# EAGLE design tablespoon-no-adc (EAGLE 6.5.0)
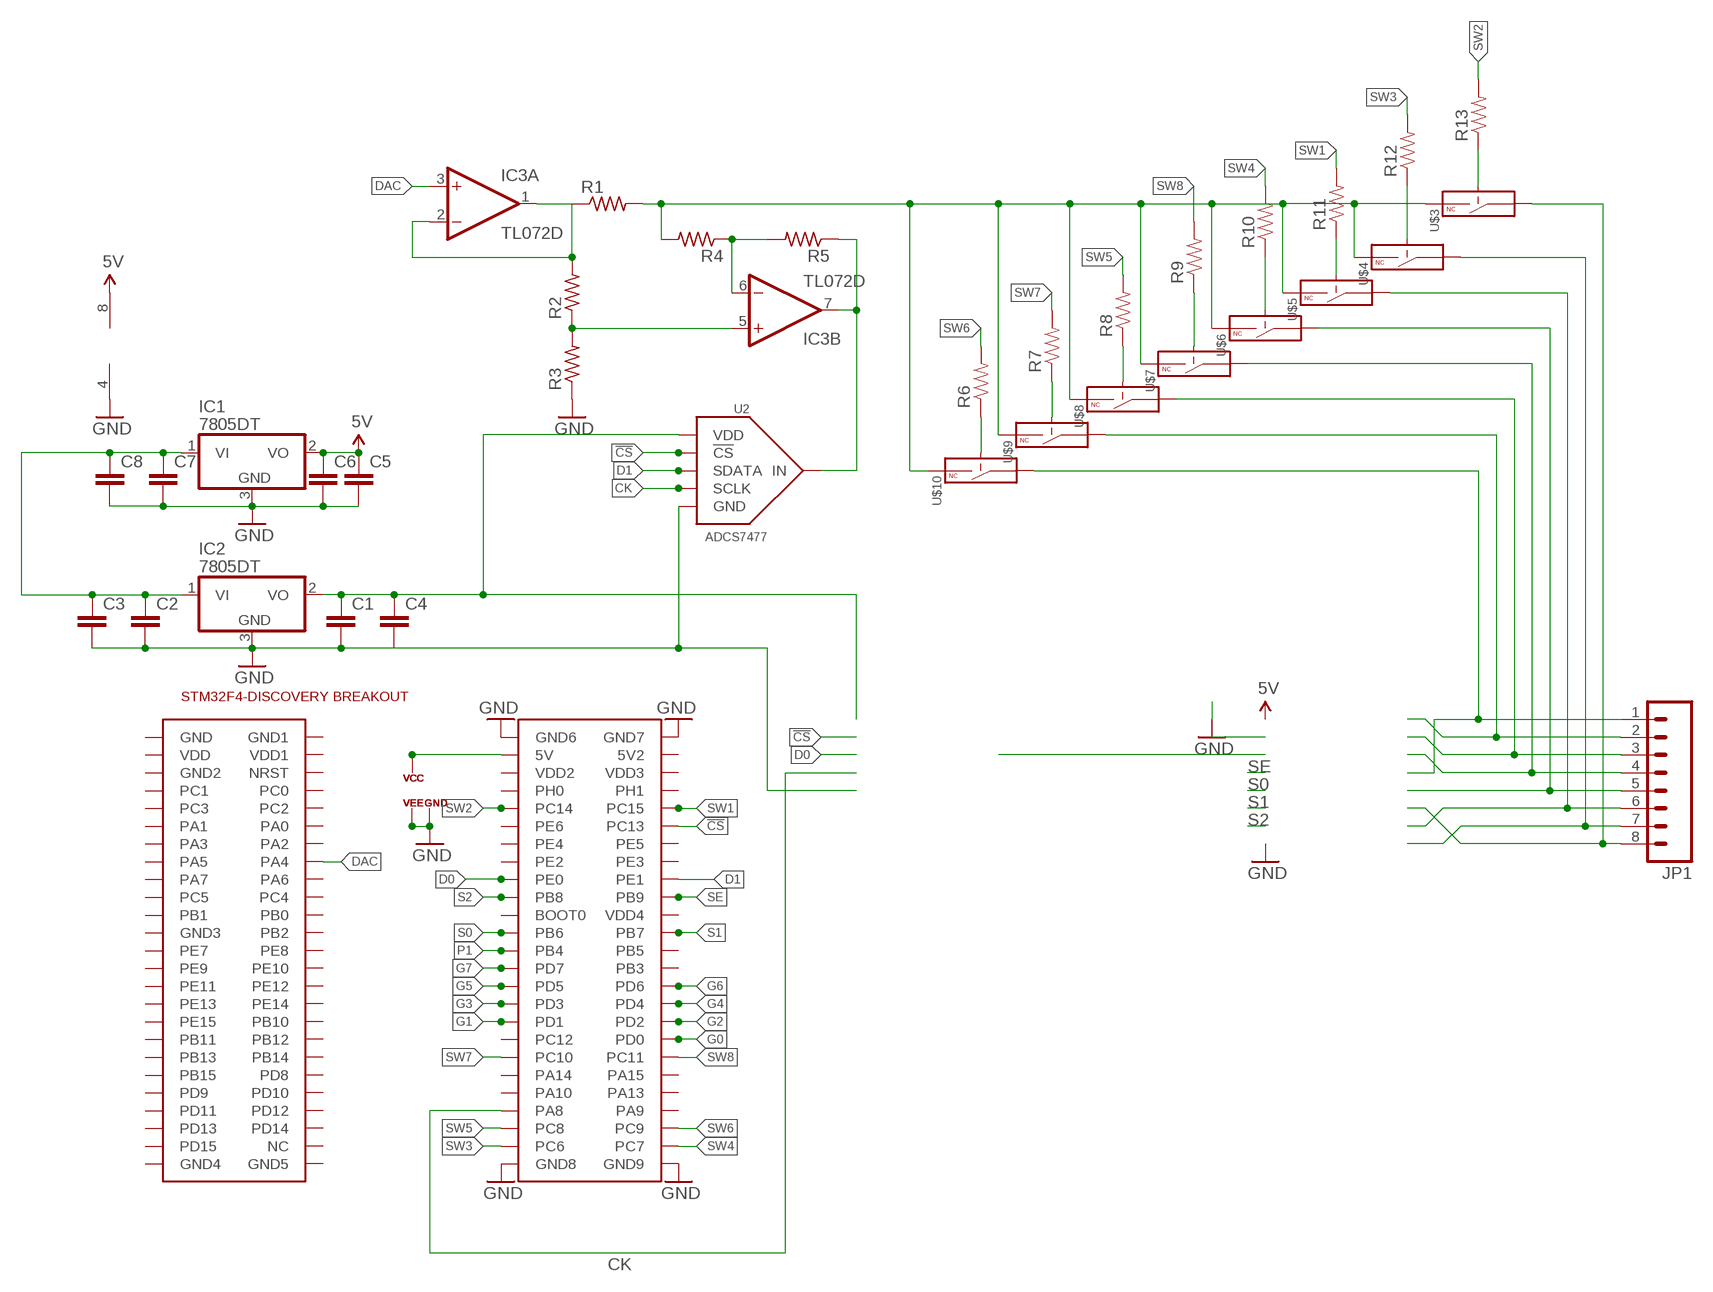
[diagram p0: schematic, sheet 1]

## Parts
C1  C-EUC0805  [C0805]
C2  C-EUC0805  [C0805]
C3  C-EUC0805  [C0805]
C4  C-EUC0805  [C0805]
C5  C-EUC0805  [C0805]
C6  C-EUC0805  [C0805]
C7  C-EUC0805  [C0805]
C8  C-EUC0805  [C0805]
IC1  7805DT  [TO252]
IC2  7805DT  [TO252]
IC3  TL072D  [SO08]
JP1  M08LONGPADS  [1X08_LONGPADS]
R1  R-US_R0603  [R0603]
R2  R-US_R0603  [R0603]
R3  R-US_R0603  [R0603]
R4  R-US_R0603  [R0603]
R5  R-US_R0603  [R0603]
R6  RESISTOR0805-RES  [0805]
R7  RESISTOR0805-RES  [0805]
R8  RESISTOR0805-RES  [0805]
R9  RESISTOR0805-RES  [0805]
R10  RESISTOR0805-RES  [0805]
R11  RESISTOR0805-RES  [0805]
R12  RESISTOR0805-RES  [0805]
R13  RESISTOR0805-RES  [0805]
U2  ADCS7477  [SOT-23-6]
U$1  STM32F4-DISCOVERY  [STM32F4-DISCOVERY]
U$3  DG467  [TSSOP-6]
U$4  DG467  [TSSOP-6]
U$5  DG467  [TSSOP-6]
U$6  DG467  [TSSOP-6]
U$7  DG467  [TSSOP-6]
U$8  DG467  [TSSOP-6]
U$9  DG467  [TSSOP-6]
U$10  DG467  [TSSOP-6]

## Nets
4.6V: U$1.P$53(5V) U$3.P$5(VCC) U$4.P$5(VCC) U$5.P$5(VCC) U$6.P$5(VCC) U$7.P$5(VCC) U$8.P$5(VCC) U$9.P$5(VCC) U$10.P$5(VCC)
5V: C5.1 C6.1 IC1.2(VO) IC3.8(P:V+)
!CS: U2.P$6(!CS) U$1.P$62(PC13)
CK: U2.P$4(SCLK) U$1.P$93(PA8)
CUR: IC3.7(B:OUT) R5.1 U2.P$3(IN)
D0: U$1.P$67(PE0)
D1: U2.P$5(SDATA) U$1.P$68(PE1)
DAC: IC3.3(A:+IN) U$1.P$16(PA4)
G0: U$1.P$86(PD0)
G1: U$1.P$83(PD1)
G2: U$1.P$84(PD2)
G3: U$1.P$81(PD3)
G4: U$1.P$82(PD4)
G5: U$1.P$79(PD5)
G6: U$1.P$80(PD6)
G7: U$1.P$77(PD7)
GND: C1.2 C2.2 C3.2 C4.2 C5.2 C6.2 C7.2 C8.2 IC1.3(GND) IC2.3(GND) IC3.4(P:V-) R3.1 U2.P$2(GND) U$1.P$51(GND6) U$1.P$52(GND7) U$1.P$99(GND8) U$1.P$100(GND9) U$3.P$2(VEE) U$3.P$4(GND) U$4.P$2(VEE) U$4.P$4(GND) U$5.P$2(VEE) U$5.P$4(GND) U$6.P$2(VEE) U$6.P$4(GND) U$7.P$2(VEE) U$7.P$4(GND) U$8.P$2(VEE) U$8.P$4(GND) U$9.P$2(VEE) U$9.P$4(GND) U$10.P$2(VEE) U$10.P$4(GND)
N$2: C1.1 C4.1 IC2.2(VO) U2.P$1(VDD)
N$4: R6.1 U$10.P$3(CTL)
N$5: C2.1 C3.1 C7.1 C8.1 IC1.1(VI) IC2.1(VI)
N$6: JP1.4 U$7.P$6(COM)
N$7: R7.1 U$9.P$3(CTL)
N$8: IC3.1(A:OUT) IC3.2(A:-IN) R1.1 R2.2
N$9: JP1.5 U$6.P$6(COM)
N$10: JP1.3 U$8.P$6(COM)
N$11: JP1.1 U$10.P$6(COM)
N$12: JP1.2 U$9.P$6(COM)
N$13: IC3.5(B:+IN) R2.1 R3.2
N$14: IC3.6(B:-IN) R4.1 R5.2
N$15: R8.1 U$8.P$3(CTL)
N$16: R1.2 R4.2 U$3.P$1(IN) U$4.P$1(IN) U$5.P$1(IN) U$6.P$1(IN) U$7.P$1(IN) U$8.P$1(IN) U$9.P$1(IN) U$10.P$1(IN)
N$17: R9.1 U$7.P$3(CTL)
N$18: R12.1 U$4.P$3(CTL)
N$19: R13.1 U$3.P$3(CTL)
N$20: R11.1 U$5.P$3(CTL)
N$21: R10.1 U$6.P$3(CTL)
N$27: JP1.6 U$5.P$6(COM)
N$28: JP1.7 U$4.P$6(COM)
N$29: JP1.8 U$3.P$6(COM)
P1: U$1.P$75(PB4)
S0: U$1.P$73(PB6)
S1: U$1.P$74(PB7)
S2: U$1.P$69(PB8)
SE: U$1.P$70(PB9)
SW1: R11.2 U$1.P$60(PC15)
SW2: R13.2 U$1.P$59(PC14)
SW3: R12.2 U$1.P$97(PC6)
SW4: R10.2 U$1.P$98(PC7)
SW5: R8.2 U$1.P$95(PC8)
SW6: R6.2 U$1.P$96(PC9)
SW7: R7.2 U$1.P$87(PC10)
SW8: R9.2 U$1.P$88(PC11)
Unconnected: U$1.P$1(GND) U$1.P$2(GND1) U$1.P$3(VDD) U$1.P$4(VDD1) U$1.P$5(GND2) U$1.P$6(NRST) U$1.P$7(PC1) U$1.P$8(PC0) U$1.P$9(PC3) U$1.P$10(PC2) U$1.P$11(PA1) U$1.P$12(PA0) U$1.P$13(PA3) U$1.P$14(PA2) U$1.P$15(PA5) U$1.P$17(PA7) U$1.P$18(PA6) U$1.P$19(PC5) U$1.P$20(PC4) U$1.P$21(PB1) U$1.P$22(PB0) U$1.P$23(GND3) U$1.P$24(PB2) U$1.P$25(PE7) U$1.P$26(PE8) U$1.P$27(PE9) U$1.P$28(PE10) U$1.P$29(PE11) U$1.P$30(PE12) U$1.P$31(PE13) U$1.P$32(PE14) U$1.P$33(PE15) U$1.P$34(PB10) U$1.P$35(PB11) U$1.P$36(PB12) U$1.P$37(PB13) U$1.P$38(PB14) U$1.P$39(PB15) U$1.P$40(PD8) U$1.P$41(PD9) U$1.P$42(PD10) U$1.P$43(PD11) U$1.P$44(PD12) U$1.P$45(PD13) U$1.P$46(PD14) U$1.P$47(PD15) U$1.P$48(NC) U$1.P$49(GND4) U$1.P$50(GND5) U$1.P$54(5V2) U$1.P$55(VDD2) U$1.P$56(VDD3) U$1.P$57(PH0) U$1.P$58(PH1) U$1.P$61(PE6) U$1.P$63(PE4) U$1.P$64(PE5) U$1.P$65(PE2) U$1.P$66(PE3) U$1.P$71(BOOT0) U$1.P$72(VDD4) U$1.P$76(PB5) U$1.P$78(PB3) U$1.P$85(PC12) U$1.P$89(PA14) U$1.P$90(PA15) U$1.P$91(PA10) U$1.P$92(PA13) U$1.P$94(PA9)

## Library data of the parts
C1-C8 = rcl:C-EU: CAPACITOR, European symbol
IC1 IC2 = linear:78*: Positive VOLTAGE REGULATOR Source: http://cache.national.com/ds/LM/LM78L05.pdf http://www.fairchildsemi.com/ds/LM/LM7805.pdf
IC3 = linear:TL072: OP AMP
JP1 = SparkFun-Connectors:M08: Header 8 Standard 8-pin 0.1" header. Use with straight break away headers (SKU : PRT-00116), right angle break away headers (PRT-00553), swiss pins (PRT-00743), machine pins (PRT-00117), and female headers (PRT-00115).
R1-R5 = rcl:R-US_: RESISTOR, American symbol
R6-R13 = SparkFun-Passives:RESISTOR: Resistor Basic schematic elements and footprints for 0603, 1206, and PTH resistors.
U2 = butter:ADCS7477: TI ADCS7477 10 bit 1MSPS ADC 5V 10mW Digikey <http://www.digikey.com/product-detail/en/ADCS7477AIMF%2FNOPB/ADCS7477AIMF%2FNOPBTR-ND/568478>
U$1 = STM32F4-DISCOVERY:STM32F4-DISCOVERY
U$3-U$10 = butter:DG467

## Board
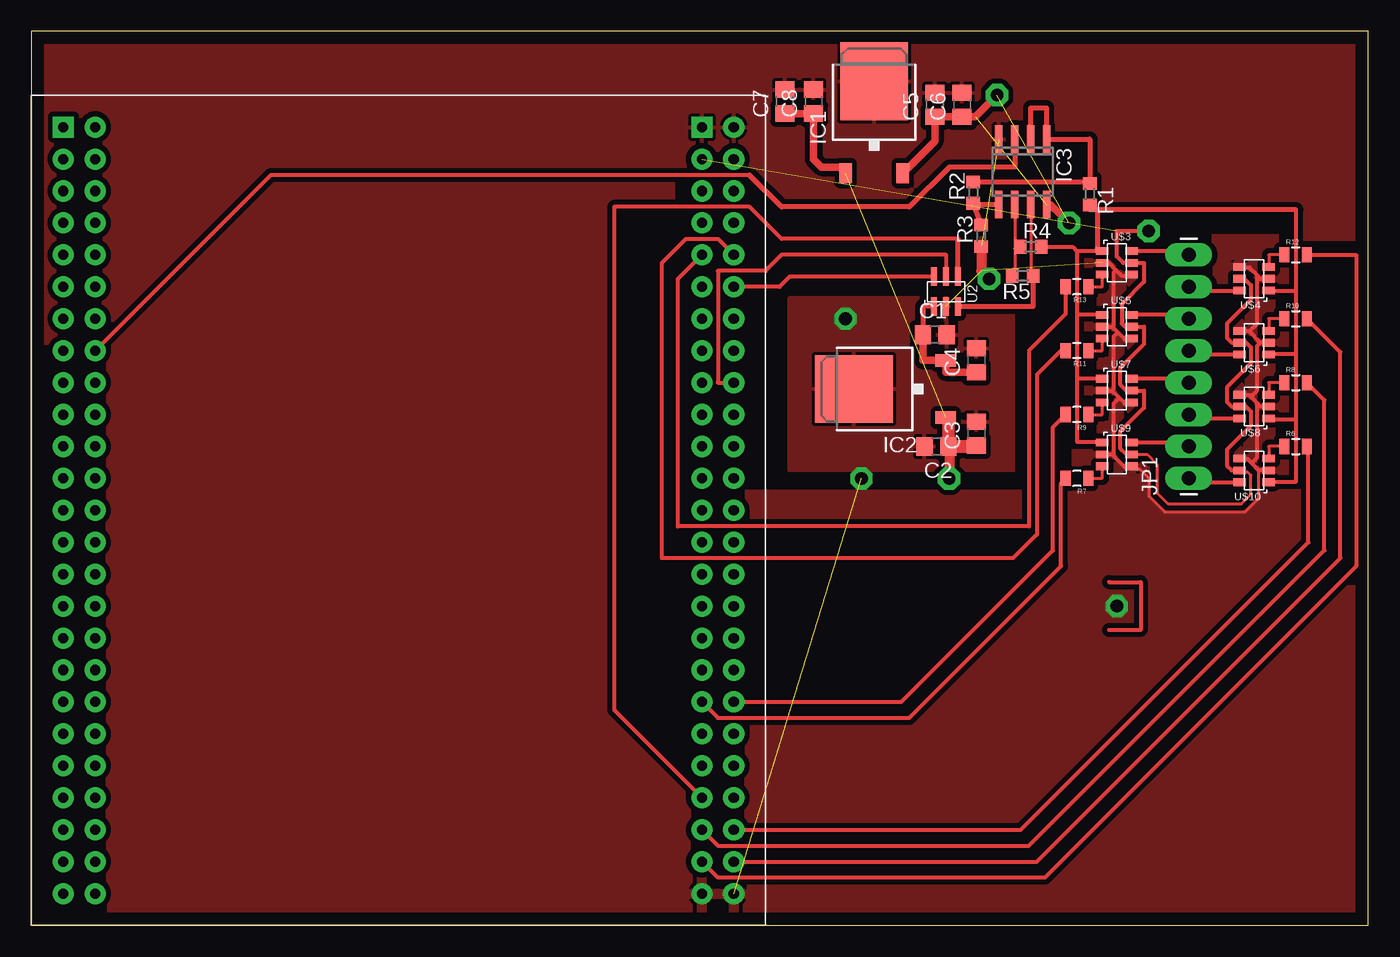
[diagram p1: board, top side]

Size 106.35 x 71.11 mm. Coordinates in mm from the lower left corner, seen from the top.
Outline: 0,0 106.35,0 106.35,71.11 0,71.11 0,0
Copper layers (1*16): Top 0.035mm / dielectric 1.5mm / Bottom 0.035mm
Design rules "default": minimum track width 10mil, minimum drill 24mil, track to track 8mil, track to pad 8mil, pad to pad 8mil, via to via 8mil, smd to smd 8mil, copper to edge 40mil, drill to drill 8mil, minimum pad ring 10mil, minimum via ring 8mil, stop-mask expansion 4mil, vias tented up to drill 0mil, thermal gap 10mil

### Footprints (pad centres in the part's own frame; a part is rotated, then mirrored left to right if it is on the bottom)
C0805 = smd 1.3 x 1.5: 1 -0.95,0; 2 0.95,0
TO252 = smd 1 x 1.6: 1 -2.28,-4.8; 2 2.28,-4.8 | smd 5.4 x 6.2: 3 0,2.5
SO08 = smd 0.6 x 2.2: 1 -1.905,-2.6; 2 -0.635,-2.6; 3 0.635,-2.6; 4 1.905,-2.6; 5 1.905,2.6; 6 0.635,2.6; 7 -0.635,2.6; 8 -1.905,2.6
1X08_LONGPADS = drill 1.118 pad 1.88 long: 1 0,0; 2 2.54,0; 3 5.08,0; 4 7.62,0; 5 10.16,0; 6 12.7,0; 7 15.24,0; 8 17.78,0
R0603 = smd 1 x 1.1: 1 -0.85,0; 2 0.85,0
0805 = smd 0.8 x 1.2: 1 -0.9,0; 2 0.9,0
SOT-23-6 = smd 1.473 x 0.483: P$1 -1.181,0.95; P$2 -1.181,0; P$3 -1.181,-0.95; P$4 1.181,-0.95; P$5 1.181,0; P$6 1.181,0.95
STM32F4-DISCOVERY = drill 0.8 pad 1.676 square: P$1 -27.94,30.48; P$51 22.86,30.48 | drill 0.8 pad 1.676: P$2 -25.4,30.48; P$3 -27.94,27.94; P$4 -25.4,27.94; P$5 -27.94,25.4; P$6 -25.4,25.4; P$7 -27.94,22.86; P$8 -25.4,22.86; P$9 -27.94,20.32; P$10 -25.4,20.32; P$11 -27.94,17.78; P$12 -25.4,17.78; P$13 -27.94,15.24; P$14 -25.4,15.24; P$15 -27.94,12.7; P$16 -25.4,12.7; P$17 -27.94,10.16; P$18 -25.4,10.16; P$19 -27.94,7.62; P$20 -25.4,7.62; P$21 -27.94,5.08; P$22 -25.4,5.08; P$23 -27.94,2.54; P$24 -25.4,2.54; P$25 -27.94,0; P$26 -25.4,0; P$27 -27.94,-2.54; P$28 -25.4,-2.54; P$29 -27.94,-5.08; P$30 -25.4,-5.08; P$31 -27.94,-7.62; P$32 -25.4,-7.62; P$33 -27.94,-10.16; P$34 -25.4,-10.16; P$35 -27.94,-12.7; P$36 -25.4,-12.7; P$37 -27.94,-15.24; P$38 -25.4,-15.24; P$39 -27.94,-17.78; P$40 -25.4,-17.78; P$41 -27.94,-20.32; P$42 -25.4,-20.32; P$43 -27.94,-22.86; P$44 -25.4,-22.86; P$45 -27.94,-25.4; P$46 -25.4,-25.4; P$47 -27.94,-27.94; P$48 -25.4,-27.94; P$49 -27.94,-30.48; P$50 -25.4,-30.48; P$52 25.4,30.48; P$53 22.86,27.94; P$54 25.4,27.94; P$55 22.86,25.4; P$56 25.4,25.4; P$57 22.86,22.86; P$58 25.4,22.86; P$59 22.86,20.32; P$60 25.4,20.32; P$61 22.86,17.78; P$62 25.4,17.78; P$63 22.86,15.24; P$64 25.4,15.24; P$65 22.86,12.7; P$66 25.4,12.7; P$67 22.86,10.16; P$68 25.4,10.16; P$69 22.86,7.62; P$70 25.4,7.62; P$71 22.86,5.08; P$72 25.4,5.08; P$73 22.86,2.54; P$74 25.4,2.54; P$75 22.86,0; P$76 25.4,0; P$77 22.86,-2.54; P$78 25.4,-2.54; P$79 22.86,-5.08; P$80 25.4,-5.08; P$81 22.86,-7.62; P$82 25.4,-7.62; P$83 22.86,-10.16; P$84 25.4,-10.16; P$85 22.86,-12.7; P$86 25.4,-12.7; P$87 22.86,-15.24; P$88 25.4,-15.24; P$89 22.86,-17.78; P$90 25.4,-17.78; P$91 22.86,-20.32; P$92 25.4,-20.32; P$93 22.86,-22.86; P$94 25.4,-22.86; P$95 22.86,-25.4; P$96 25.4,-25.4; P$97 22.86,-27.94; P$98 25.4,-27.94; P$99 22.86,-30.48; P$100 25.4,-30.48
TSSOP-6 = smd 0.991 x 0.61: P$1 -1.161,0.94; P$2 -1.161,0; P$3 -1.161,-0.94; P$4 1.161,-0.94; P$5 1.161,0; P$6 1.161,0.94

### Placement (x,y rotation side)
C1  71.88,46.99 0 top
C2  72.01,38.1 180 top
C3  75.18,39.12 90 top
C4  75.18,44.96 90 top
C5  71.88,65.28 90 top
C6  74.04,65.28 90 top
C7  59.94,65.53 90 top
C8  62.23,65.53 90 top
IC1  67.06,64.64 0 top
IC2  67.94,42.67 90 top
IC3  78.87,59.94 180 top
JP1  92.08,35.56 90 top
R1  84.2,58.17 270 top
R2  74.93,58.29 90 top
R3  75.56,54.86 90 top
R4  79.5,53.98 0 top
R5  78.87,51.69 180 top
R6  100.58,38.1 0 top
R7  83.19,35.56 180 top
R8  100.58,43.18 0 top
R9  83.19,40.64 180 top
R10  100.58,48.26 0 top
R11  83.19,45.72 180 top
R12  100.58,53.34 0 top
R13  83.19,50.8 180 top
U2  72.77,50.42 90 top
U$1  30.48,33.02 0 top
U$3  86.36,52.7 0 top
U$4  97.28,51.44 180 top
U$5  86.36,47.62 0 top
U$6  97.28,46.35 180 top
U$7  86.36,42.55 0 top
U$8  97.28,41.27 180 top
U$9  86.36,37.47 0 top
U$10  97.28,36.2 180 top

### Tracks (layer width: path | path; a pad name or v marks a point on that pad's centre or on a via)
4.6V  (1 unrouted)
  Top 0.254: 88.52,42.55 88.52,41.15 86.61,39.24 | 87.12,37.47 88.77,37.47 89.53,36.7 89.53,34.42 90.42,33.53 96.27,33.53 97.03,34.29 97.03,35.81 96.77,36.07 96.25,36.07 U$10.P$5
  Top 0.305: U$9.P$5 87.12,37.47 86.61,37.97 86.61,39.24 86.61,39.27 88.52,41.17 88.52,42.55 U$7.P$5 87.12,42.55 86.61,43.05 86.61,44.34 88.52,46.24 88.52,47.62 U$5.P$5 87,47.62 86.74,47.88 86.74,49.4 88.52,51.18 88.52,52.7 U$3.P$5 86.87,52.7 86.36,53.21 86.36,55.24 88.27,55.24 | U$10.P$5 95.5,36.2 95.12,36.58 95.12,37.85 97.03,39.75 97.03,40.89 96.65,41.27 U$8.P$5 95.5,41.27 95.12,41.66 95.12,42.8 97.03,44.7 97.03,45.97 96.65,46.35 U$6.P$5 95.5,46.35 95.12,46.74 95.12,47.88 97.03,49.78 97.03,50.93 96.52,51.44 U$4.P$5
5V  (1 unrouted)
  Top 0.61: IC1.2 71.88,62.39 C5.1 C6.1 75.12,64.33 76.2,65.41 | IC3.8 81.09,57.34 81.92,56.52
!CS
  Top 0.305: U2.P$6 60.33,51.6 59.52,50.8 U$1.P$62
CK
  Top 0.305: 73.72,54.61 59.69,54.61 57.15,57.15 46.35,57.15 46.35,17.14 U$1.P$93
  Top 0.406: U2.P$4 73.72,54.61
CUR
  Top 0.254: IC3.7 79.5,51.9 R5.1
  Top 0.406: U2.P$3 79.72,49.24 R5.1
D1
  Top 0.305: U$1.P$68 54.61,43.18 54.61,52.07 58.42,52.07 59.69,53.34 72.77,53.34 U2.P$5
DAC
  Top 0.305: 57.15,59.69 19.05,59.69 U$1.P$16
  Top 0.406: IC3.3 78.23,60.33 73.03,60.33 69.85,57.15 59.69,57.15 57.15,59.69
GND  (via drill 1 pad 1.78)  (4 unrouted)
  Top 0.254: 85.98,37.47 87.12,36.32 88.14,36.32 88.9,35.56 88.9,34.16 90.17,32.89 96.58,32.89 97.66,33.98 97.66,36.2
  Top 0.305: U$3.P$2 85.72,52.7 86.3,52.13 | 86.3,52.13 86.74,51.69 87.44,51.69 | U$5.P$2 85.98,47.62 | 85.98,47.62 86.42,47.18 | 86.42,47.18 87,46.61 87.44,46.61 | U$7.P$2 85.98,42.55 | 85.98,42.55 86.49,42.04 | 86.49,42.04 87,41.53 87.44,41.53 | 85.98,37.47 87,36.45 87.44,36.45 | U$9.P$2 85.98,37.47 | 85.98,37.47 86.11,37.59 86.11,41.53 86.49,41.91 86.49,42.04 | 85.98,42.55 86.11,42.67 86.11,46.86 86.42,47.18 | 85.98,47.62 86.11,47.75 86.11,51.94 86.3,52.13 | 97.03,36.83 96.77,37.08 96.17,37.08 U$10.P$4 | U$8.P$2 97.79,41.27 97.54,41.53 | 97.54,41.53 96.9,42.16 | 96.9,42.16 96.17,42.16 U$8.P$4 | U$6.P$2 97.79,46.35 | 97.79,46.35 96.9,47.24 | 96.9,47.24 96.17,47.24 U$6.P$4 | U$4.P$2 97.79,51.44 97.6,51.63 | 97.6,51.63 96.9,52.32 96.17,52.32 U$4.P$4 | U$10.P$2 97.66,36.2 97.03,36.83 | 97.03,36.83 97.16,36.83 97.54,37.21 97.54,41.53 | 96.9,42.16 97.16,42.16 97.54,42.55 97.54,46.1 97.79,46.35 | 96.9,47.24 97.54,47.88 97.54,51.56 97.6,51.63
  Top 0.406: 87.44,51.69 U$3.P$4 | 87.44,46.61 U$5.P$4 | 87.44,41.53 U$7.P$4 | 87.44,36.45 U$9.P$4
  Top 0.813: R3.1 75.56,52.07
  other vias: 64.77,48.26 66.04,35.56 86.36,25.4
  pour Top (isolate 0.406): 60.33,49.91 78.11,49.91 78.11,36.2 60.33,36.2
  pour Top (isolate 0.406): 0,71.12 0,46.35 5.08,46.35 13.34,54.61 106.05,54.61 106.05,71.12
  pour Top (isolate 0.406): 58.42,34.29 83.19,34.29 83.19,54.61 106.68,54.61 106.68,0 -0.64,0 -1.27,0 -1.27,71.75 50.8,71.75 50.8,34.29
N$1  (via drill 1 pad 1.78)  (1 unrouted)
  other vias: 76.83,66.04 82.55,55.88
N$2
  Top 0.406: U2.P$1 70.93,49.24 C1.1
  Top 0.61: C4.1 72.75,44.01 IC2.2 70.93,44.95 C1.1
N$3  (via drill 1 pad 1.78)
  other vias: 76.2,51.44
N$4
  Top 0.254: R6.1 98.44,38.1 U$10.P$3
N$5  (1 unrouted)
  Top 0.61: IC2.1 72.75,38.31 C2.1 | C7.1 C8.1 62.23,60.96 62.87,60.33 64.29,60.33 IC1.1
  Top 0.813: IC2.1 73.03,40.39 73.03,36.2
  Top 1.016: C2.1 75.12,38.1 C3.1
N$6
  Top 0.305: 87.6,43.56 U$7.P$6 91.77,43.48 JP1.4
N$7
  Top 0.254: R7.1 85.2,35.56 U$9.P$3
N$8
  Top 0.406: R2.2 84.2,59.14 R1.1 84.2,62.54 IC3.1 80.77,65.02 79.5,65.02 IC3.2
N$9
  Top 0.305: JP1.5 92.38,45.41 U$6.P$6
N$10
  Top 0.305: JP1.3 92.38,40.34 U$8.P$6
N$11
  Top 0.305: JP1.1 92.38,35.26 U$10.P$6
N$12
  Top 0.305: 87.6,38.48 U$9.P$6 91.77,38.41 JP1.2
N$13
  Top 0.406: R2.1 74.93,57.34 | 74.93,57.34 R3.2 | IC3.5 74.93,57.34
N$14
  Top 0.254: IC3.6 78.23,53.85 | 78.23,53.85 78.23,51.9 R5.2 | R4.1 78.36,53.98 78.23,53.85
N$15
  Top 0.254: R8.1 98.44,43.18 U$8.P$3
N$16
  Top 0.305: U$3.P$1 83.19,53.65 | 83.19,53.65 83.19,48.56 | 83.19,48.56 83.19,43.48 | 83.19,43.48 83.19,38.48 85.2,38.48 U$9.P$1 | U$5.P$1 83.19,48.56 | U$7.P$1 83.19,43.48 | U$4.P$1 100.58,50.49 | 100.58,50.49 100.58,45.47 | 100.58,45.47 100.58,40.26 | 100.58,40.26 100.58,35.26 U$10.P$1 | U$6.P$1 98.44,45.47 100.58,45.47 | U$8.P$1 98.44,40.26 100.58,40.26 | 100.58,56.94 100.58,50.49 | R4.2 82.86,53.98 83.19,53.65
  Top 0.406: 100.58,56.94 84.84,56.94 | 84.84,56.94 84.2,56.94 R1.2 | U$3.P$1 84.84,53.65 84.84,56.94
N$17
  Top 0.254: R9.1 85.2,40.64 U$7.P$3
N$18
  Top 0.254: R12.1 98.44,53.34 U$4.P$3
N$19
  Top 0.254: R13.1 85.2,50.8 U$3.P$3
N$20
  Top 0.254: R11.1 85.2,45.72 U$5.P$3
N$21
  Top 0.254: R10.1 98.44,48.26 U$6.P$3
N$22  (via drill 1 pad 1.78)
  other vias: 88.9,55.24
N$23  (via drill 1 pad 1.78)
  other vias: 73.03,35.56
N$24
  Top 0.305: 85.72,27.3 88.27,27.3 88.27,23.5 85.72,23.5
N$27
  Top 0.305: 87.6,48.64 U$5.P$6 91.77,48.56 JP1.6
N$28
  Top 0.305: JP1.7 92.38,50.49 U$4.P$6
N$29
  Top 0.305: 87.6,53.72 U$3.P$6 91.77,53.65 JP1.8
SW1
  Top 0.305: R11.2 81.92,45.72 80.01,43.81 80.01,31.11 78.11,29.21 50.16,29.21 50.16,52.7 52.07,54.61 54.61,54.61 U$1.P$60
SW2
  Top 0.305: U$1.P$59 51.44,51.44 51.44,31.75 79.38,31.75 79.38,45.72 82.28,48.63 R13.2
SW3
  Top 0.305: R12.2 105.41,53.34 105.41,28.57 80.64,3.81 54.61,3.81 U$1.P$97
SW4
  Top 0.305: U$1.P$98 80.01,5.08 104.14,29.21 104.14,45.6 R10.2
SW5
  Top 0.305: U$1.P$95 54.61,6.35 79.38,6.35 102.87,29.84 102.87,41.79 R8.2
SW6
  Top 0.305: U$1.P$96 78.74,7.62 101.6,30.48 101.6,37.98 R6.2
SW7
  Top 0.305: U$1.P$87 54.61,16.51 69.85,16.51 81.92,28.57 81.92,35.19 R7.2
SW8
  Top 0.305: U$1.P$88 69.22,17.78 81.28,29.84 81.28,39.63 R9.2